# EasyEDA Pro project Test.eprj

# Schematic Schematic1
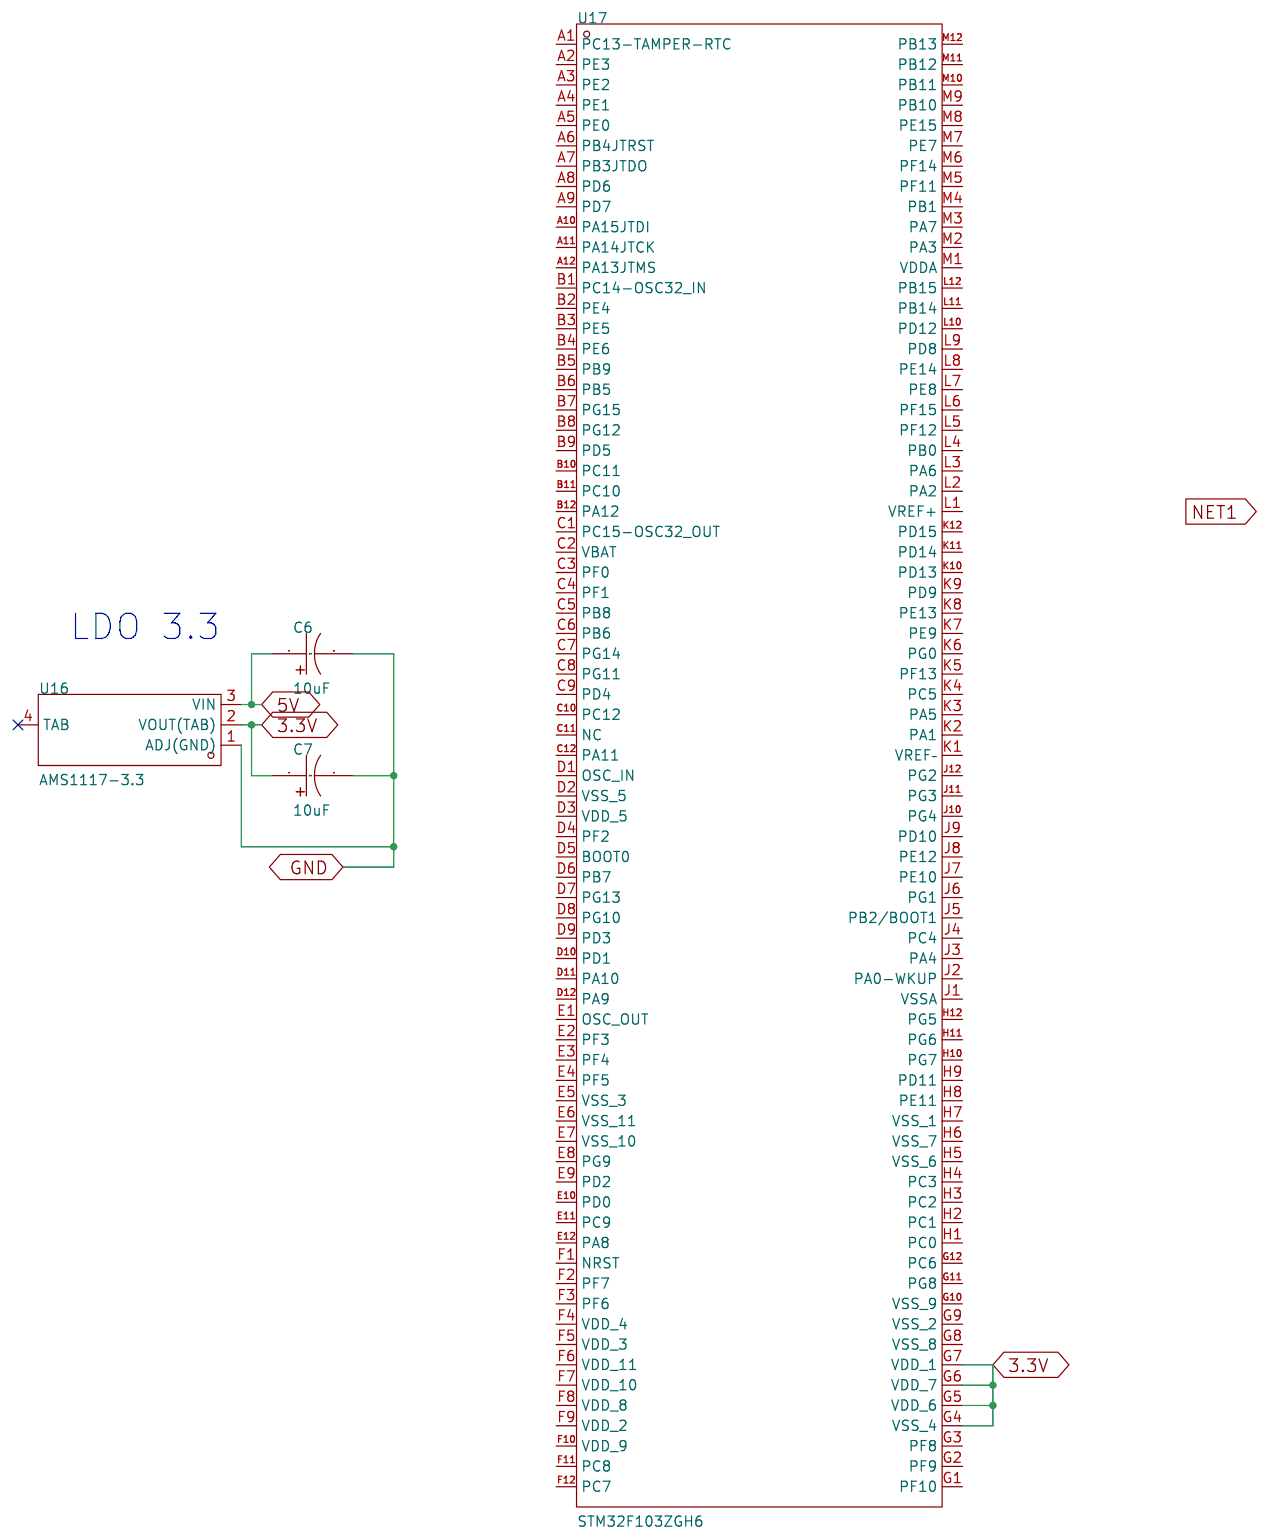
[diagram p0: schematic sheet]

## Parts
C6  10uF  [CAP-SMD_BD4.0-L4.3-W4.3-FD-LS5.1]
C7  10uF  [CAP-SMD_BD4.0-L4.3-W4.3-FD-LS5.1]
U16  AMS1117-3.3  [SOT-223-4_L6.5-W3.5-P2.30-LS7.0-BR]
U17  STM32F103ZGH6  [CSPBGA-144_L10.0-W10.0-R12-C12-P0.80-TL]

## Library data of the parts
C6 C7 = VSS100M1CTR-0404: Capacitance: Tolerance:±20% Tolerance:±20% Rated Voltage: Ripple Current:- Equivalent Series Resistance(ESR):- φD: L: Lifetime @ Temp:2000hrs@85℃ Operating Temperature:-40℃~+85℃ Operating Temperature:-40℃~+85℃; LCSC Part Name: 10uF ±20% 16V; Supplier Part: C249787; Manufacturer: lelon(立隆); Supplier Footprint: SMD,D4xL4.5mm; JLCPCB Part Class: Extended Part; Datasheet: https://atta.szlcsc.com/upload/public/pdf/source/20181120/C249792_E78EF1C7C73E84F51169EB1D068529A5.pdf; Supplier: LCSC; Tolerance: ±20%; Lifetime @ Temp: 2000hrs@85℃; Operating Temperature: -40℃~+85℃
U16 = AMS1117-3.3_C347222: Output Type: Maximum Input Voltage:12V Output Voltage:3.3V Output Voltage:3.3V MAX Output Current:1A Power Supply Rejection Ratio (PSRR):60dB@(120Hz) Dropout Voltage:1.3V@(1A) standby current:- Noise:- Feature:- Operating Temperature:- Operating Temperatu; LCSC Part Name: 输出:3.3V 电流:1A 耐压:12V; Supplier Part: C347222; Manufacturer: UMW(友台半导体); Supplier Footprint: SOT-223; JLCPCB Part Class: Extended Part; Datasheet: https://atta.szlcsc.com/upload/public/pdf/source/20231109/155D79A26D9DB04352555A58D5969DC8.pdf; Supplier: LCSC; Maximum Input Voltage: 12V; Output Voltage: 3.3V; MAX Output Current: 1A; Power Supply Rejection Ratio (PSRR): 60dB@(120Hz); Dropout Voltage: 1.3V@(1A); Output Polarity: Positive electrode; Number of Outputs: 1
U17 = STM32F103ZGH6: LCSC Part Name: 主流增强型ARM Cortex-M3 MCU，具有1 MB Flash、72 MHz CPU、电机控制、USB和CAN; Supplier Part: C1337154; Manufacturer: ST(意法半导体); Supplier Footprint: LFBGA-144; JLCPCB Part Class: Extended Part; Datasheet: https://atta.szlcsc.com/upload/public/pdf/source/20170728/C44011_1501225882222849055.pdf; Supplier: LCSC; CPU Core: ARM-M3; CPU Maximum Speed: 72MHz; Program Storage Size: 1MB; Program Memory Type: FLASH; Number of I/O: 112; ADC (Bit): 12bit; DAC (Bit): 12bit; Low Voltage Detection Threshold: 2V~3.6V

## Nets
3.3V: C7.1 U16.2(VOUT(TAB)) U17.G4(VSS_4) U17.G5(VDD_6) U17.G6(VDD_7) U17.G7(VDD_1)
5V: C6.1 U16.3(VIN)
GND: C6.2 C7.2 U16.1(ADJ(GND))

Not connected (* = marked no-connect by the designer): U16 4(TAB)*; U17 A1(PC13-TAMPER-RTC) A2(PE3) A3(PE2) A4(PE1) A5(PE0) A6(PB4JTRST) A7(PB3JTDO) A8(PD6) A9(PD7) A10(PA15JTDI) A11(PA14JTCK) A12(PA13JTMS) B1(PC14-OSC32_IN) B2(PE4) B3(PE5) B4(PE6) B5(PB9) B6(PB5) B7(PG15) B8(PG12) B9(PD5) B10(PC11) B11(PC10) B12(PA12) C1(PC15-OSC32_OUT) C2(VBAT) C3(PF0) C4(PF1) C5(PB8) C6(PB6) C7(PG14) C8(PG11) C9(PD4) C10(PC12) C11(NC) C12(PA11) D1(OSC_IN) D2(VSS_5) D3(VDD_5) D4(PF2) D5(BOOT0) D6(PB7) D7(PG13) D8(PG10) D9(PD3) D10(PD1) D11(PA10) D12(PA9) E1(OSC_OUT) E2(PF3) E3(PF4) E4(PF5) E5(VSS_3) E6(VSS_11) E7(VSS_10) E8(PG9) E9(PD2) E10(PD0) E11(PC9) E12(PA8) F1(NRST) F2(PF7) F3(PF6) F4(VDD_4) F5(VDD_3) F6(VDD_11) F7(VDD_10) F8(VDD_8) F9(VDD_2) F10(VDD_9) F11(PC8) F12(PC7) G1(PF10) G2(PF9) G3(PF8) G8(VSS_8) G9(VSS_2) G10(VSS_9) G11(PG8) G12(PC6) H1(PC0) H2(PC1) H3(PC2) H4(PC3) H5(VSS_6) H6(VSS_7) H7(VSS_1) H8(PE11) H9(PD11) H10(PG7) H11(PG6) H12(PG5) J1(VSSA) J2(PA0-WKUP) J3(PA4) J4(PC4) J5(PB2/BOOT1) J6(PG1) J7(PE10) J8(PE12) J9(PD10) J10(PG4) J11(PG3) J12(PG2) K1(VREF–) K2(PA1) K3(PA5) K4(PC5) K5(PF13) K6(PG0) K7(PE9) K8(PE13) K9(PD9) K10(PD13) K11(PD14) K12(PD15) L1(VREF+) L2(PA2) L3(PA6) L4(PB0) L5(PF12) L6(PF15) L7(PE8) L8(PE14) L9(PD8) L10(PD12) L11(PB14) L12(PB15) M1(VDDA) M2(PA3) M3(PA7) M4(PB1) M5(PF11) M6(PF14) M7(PE7) M8(PE15) M9(PB10) M10(PB11) M11(PB12) M12(PB13)

## Notes on the sheet
- LDO 3.3
